# EAGLE design Extender-PCB (EAGLE 7.7.0)
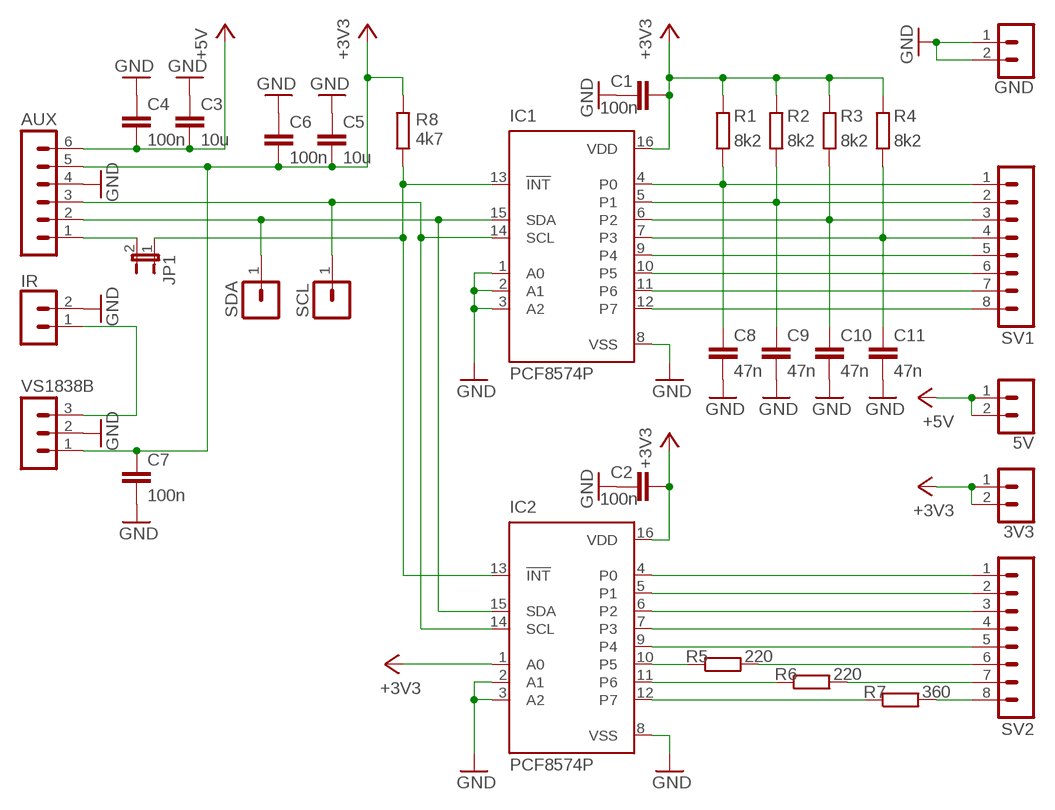
[diagram p0: schematic, sheet 1]

## Parts
3V3  MA02-1  [MA02-1]
5V  MA02-1  [MA02-1]
AUX  MA06-1  [MA06-1]
C1  100n  C-EUC1206  [C1206]
C2  100n  C-EUC1206  [C1206]
C3  10u  C-EUC1206  [C1206]
C4  100n  C-EUC1206  [C1206]
C5  10u  C-EUC1206  [C1206]
C6  100n  C-EUC1206  [C1206]
C7  100n  C-EUC1206  [C1206]
C8  47n  C-EUC1206  [C1206]
C9  47n  C-EUC1206  [C1206]
C10  47n  C-EUC1206  [C1206]
C11  47n  C-EUC1206  [C1206]
GND  MA02-1  [MA02-1]
IC1  PCF8574P  [DIL16]
IC2  PCF8574P  [DIL16]
IR  MA02-1  [MA02-1]
JP1  JP1E  [JP1]
R1  8k2  R-EU_R1206  [R1206]
R2  8k2  R-EU_R1206  [R1206]
R3  8k2  R-EU_R1206  [R1206]
R4  8k2  R-EU_R1206  [R1206]
R5  220  R-EU_0207/10  [0207/10]
R6  220  R-EU_0207/10  [0207/10]
R7  360  R-EU_0207/10  [0207/10]
R8  4k7  R-EU_0207/10  [0207/10]
SCL  MA01-1  [MA01-1]
SDA  MA01-1  [MA01-1]
SV1  MA08-1  [MA08-1]
SV2  MA08-1  [MA08-1]
VS1838B  MA03-1  [MA03-1]

## Nets
+3V3 [Stromversorgung]: 3V3.1 3V3.2 AUX.5 C1.2 C2.2 C5.2 C6.2 C7.1 IC1.16(VDD) IC2.1(A0) IC2.16(VDD) R1.2 R2.2 R3.2 R4.2 R8.2 VS1838B.1
+5V [Stromversorgung]: 5V.1 5V.2 AUX.6 C3.2 C4.2
GND [Stromversorgung]: AUX.4 C1.1 C2.1 C3.1 C4.1 C5.1 C6.1 C7.2 C8.2 C9.2 C10.2 C11.2 GND.1 GND.2 IC1.1(A0) IC1.2(A1) IC1.3(A2) IC1.8(VSS) IC2.2(A1) IC2.3(A2) IC2.8(VSS) IR.2 VS1838B.2
LED1: R5.2 SV2.6
LED2: R6.2 SV2.7
LED3: R7.2 SV2.8
N$22: AUX.1 JP1.2
N$23: IC1.13(!INT) IC2.13(!INT) JP1.1 R8.1
N$24: IR.1 VS1838B.3
P0-1: C8.1 IC1.4(P0) R1.1 SV1.1
P0-2: IC2.4(P0) SV2.1
P1-1: C9.1 IC1.5(P1) R2.1 SV1.2
P1-2: IC2.5(P1) SV2.2
P2-1: C10.1 IC1.6(P2) R3.1 SV1.3
P2-2: IC2.6(P2) SV2.3
P3-1: C11.1 IC1.7(P3) R4.1 SV1.4
P3-2: IC2.7(P3) SV2.4
P4-1: IC1.9(P4) SV1.5
P4-2: IC2.9(P4) SV2.5
P5-1: IC1.10(P5) SV1.6
P5-2: IC2.10(P5) R5.1
P6-1: IC1.11(P6) SV1.7
P6-2: IC2.11(P6) R6.1
P7-1: IC1.12(P7) SV1.8
P7-2: IC2.12(P7) R7.1
SCL: AUX.3 IC1.14(SCL) IC2.14(SCL) SCL.1
SDA: AUX.2 IC1.15(SDA) IC2.15(SDA) SDA.1

## Library data of the parts
3V3 5V GND IR = tj-library:MA02-1: PIN HEADER
AUX = con-lstb:MA06-1: PIN HEADER; OC_FARNELL: unknown; OC_NEWARK: unknown
C1-C11 = rcl:C-EU: CAPACITOR, European symbol
IC1 IC2 = micro-philips:PCF8574: I2C-Bus Remote 8-bit I/O expander http://www.semiconductors.philips.com/acrobat_download/datasheets/PCF8574_4.pdf; MPN: PCF8574PN; OC_FARNELL: 204020; OC_NEWARK: 11N8515
JP1 = jumper:JP1E: JUMPER
R1-R8 = rcl:R-EU_: RESISTOR, European symbol
SCL SDA = tj-library:MA01-1: PIN HEADER
SV1 SV2 = con-lstb:MA08-1: PIN HEADER; OC_FARNELL: unknown; OC_NEWARK: unknown
VS1838B = con-lstb:MA03-1: PIN HEADER; OC_FARNELL: unknown; OC_NEWARK: unknown

## Net classes
0 default: width 0.406 mm, clearance 0.356 mm
1 Stromversorgung: width 0.61 mm, clearance 0.356 mm

## Board
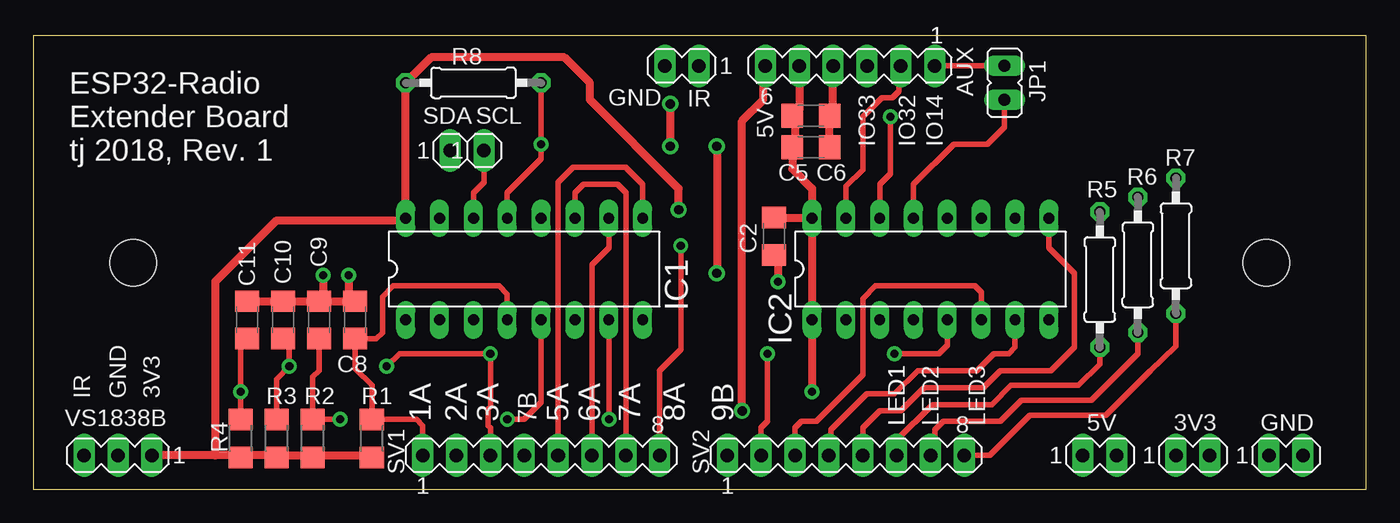
[diagram p1: board, top side]
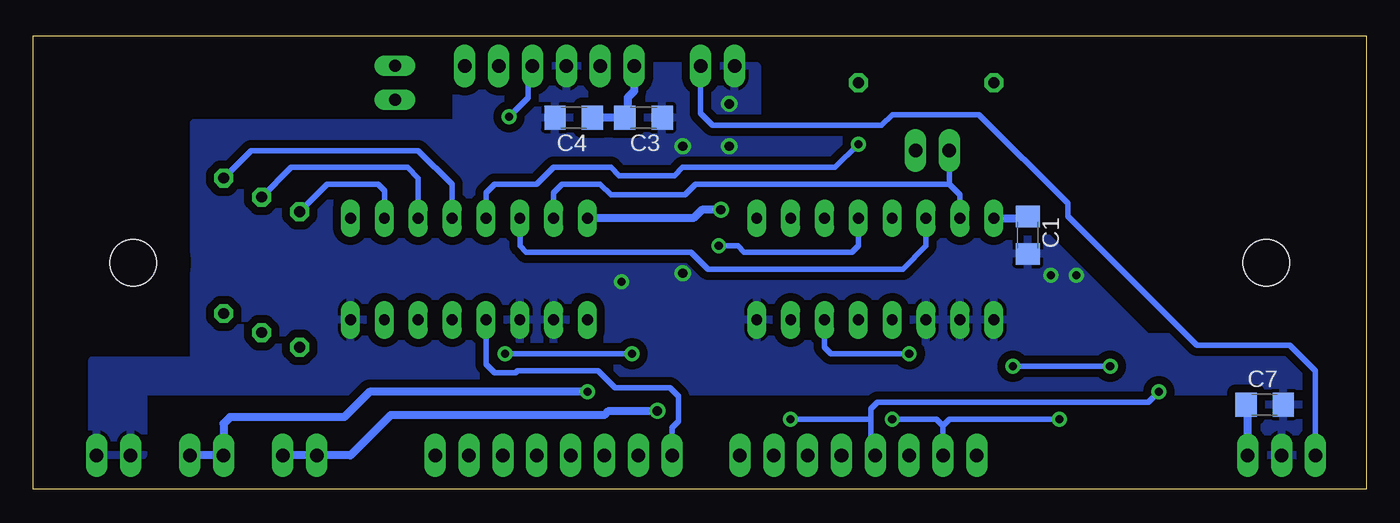
[diagram p2: board, bottom side, seen from below]

Size 100 x 34 mm. Coordinates in mm from the lower left corner, seen from the top.
Outline: 0,0 100,0 100,34 0,34 0,0
Copper layers (1*16): Top 0.035mm / dielectric 1.5mm / Bottom 0.035mm
Design rules "default *": minimum track width 10mil, minimum drill 24mil, track to track 8mil, track to pad 8mil, pad to pad 8mil, via to via 8mil, smd to smd 8mil, copper to edge 16mil, drill to drill 8mil, minimum pad ring 12mil, minimum via ring 10mil, stop-mask expansion 4mil, vias tented up to drill 0mil, thermal gap 10mil
Holes 3.5 mm at 7.5,17 92.5,17
tRestrict: area 4.7,14.2 to 10.3,19.8; area 89.8,14.2 to 95.3,19.8
bRestrict: area 4.7,14.2 to 10.3,19.8; area 89.7,14.2 to 95.3,19.8

### Footprints (pad centres in the part's own frame; a part is rotated, then mirrored left to right if it is on the bottom)
MA02-1 = drill 1.016 long: 1 -1.27,0; 2 1.27,0
MA06-1 = drill 1.016 long: 1 -6.35,0; 2 -3.81,0; 3 -1.27,0; 4 1.27,0; 5 3.81,0; 6 6.35,0
C1206 = smd 1.6 x 1.8: 1 -1.4,0; 2 1.4,0
DIL16 = drill 0.813 long: 1 -8.89,-3.81; 2 -6.35,-3.81; 3 -3.81,-3.81; 4 -1.27,-3.81; 5 1.27,-3.81; 6 3.81,-3.81; 7 6.35,-3.81; 8 8.89,-3.81; 9 8.89,3.81; 10 6.35,3.81; 11 3.81,3.81; 12 1.27,3.81; 13 -1.27,3.81; 14 -3.81,3.81; 15 -6.35,3.81; 16 -8.89,3.81
JP1 = drill 0.914 long: 1 0,-1.27; 2 0,1.27
R1206 = smd 1.6 x 1.803: 1 -1.422,0; 2 1.422,0
0207/10 = drill 0.813 octagon: 1 -5.08,0; 2 5.08,0
MA01-1 = drill 1.016 long: 1 0,0
MA08-1 = drill 1.016 long: 1 -8.89,0; 2 -6.35,0; 3 -3.81,0; 4 -1.27,0; 5 1.27,0; 6 3.81,0; 7 6.35,0; 8 8.89,0
MA03-1 = drill 1.016 long: 1 -2.54,0; 2 0,0; 3 2.54,0

### Placement (x,y rotation side)
3V3  87,2.54 0 top
5V  80.01,2.54 0 top
AUX  61.28,31.75 180 top
C1  25.4,19.05 90 bottom
C2  55.56,18.97 90 top
C3  54.21,27.86 180 bottom
C4  59.45,27.86 0 bottom
C5  58.34,28.02 180 top
C6  58.34,25.64 180 top
C7  7.62,6.35 0 bottom
C8  24.13,12.7 90 top
C9  21.43,12.7 90 top
C10  18.73,12.7 90 top
C11  16.03,12.7 90 top
GND  93.98,2.54 0 top
IC1  36.83,16.51 0 top
IC2  67.31,16.51 0 top
IR  48.66,31.75 180 top
JP1  72.87,30.48 0 top
R1  25.4,3.81 270 top
R2  20.95,3.81 270 top
R3  18.26,3.81 270 top
R4  15.56,3.81 270 top
R5  80.01,15.72 270 top
R6  82.87,16.83 270 top
R7  85.72,18.26 270 top
R8  33.02,30.48 180 top
SCL  33.81,25.4 0 top
SDA  31.27,25.4 0 top
SV1  38.1,2.54 0 top
SV2  60.96,2.54 0 top
VS1838B  6.35,2.54 180 top

### Tracks (layer width: path | path; a pad name or v marks a point on that pad's centre or on a via)
+3V3  (via drill 0.61, 0.7)
  Top 0.61: IC2.16 IC2.1 v58.42,7.3 | 17.78,2.54 15.24,2.54 | 17.78,2.54 20.32,2.54 | 17.78,2.54 R3.2 | 20.32,2.54 25.25,2.54 R1.2 | 20.32,2.54 R2.2 | 15.24,2.54 13.65,2.54 | 13.65,2.54 VS1838B.1 | 15.24,2.54 R4.2 | 13.65,2.54 13.65,15.56 18.26,20.16 27.78,20.16 IC1.16 R8.2 29.84,32.38 39.85,32.38 41.75,30.48 41.75,29.21 48.42,22.54 v48.42,20.95 | AUX.5 57.47,28.42 C5.2 57.15,27.94 57.15,26.04 C6.2 56.94,24.02 58.42,22.54 IC2.16 | C2.2 58.42,20.37 IC2.16
  Bottom 0.61: VS1838B.1 8.89,6.35 C7.1 | IC1.16 25.4,20.32 C1.2 | v58.42,7.3 74.77,7.3 76.68,5.4 85.25,5.4 85.72,4.92 3V3.1 3V3.2 | v48.42,20.95 49.85,20.95 50.48,20.32 IC2.16
+5V  (via drill 0.7)
  Top 0.61: v53.18,5.87 53.18,27.62 54.77,29.21 54.77,31.59 AUX.6
  Bottom 0.61: AUX.6 54.93,29.84 55.4,29.37 55.4,28.07 C3.2 C4.2 | 5V.2 5V.1 76.2,2.54 73.18,5.56 57.15,5.56 56.83,5.87 v53.18,5.87
GND  (via drill 0.61, 0.7)
  Top 0.61: C11.2 C10.2 C9.2 C8.2 23.65,14.58 v23.65,16.03 | C6.1 C5.1 arc-90 60.01,28.39 AUX.4 | C2.1 55.88,17.57 v55.88,15.56 | v47.78,28.89 v47.78,25.72 | v51.28,25.72 v51.28,16.19 | v21.75,16.03 21.75,13.97
  pour Bottom (isolate 0.61): 5.08,1.27 7.62,1.27 7.62,7.3 91.76,7.3 91.76,2.54 95.57,2.54 95.57,9.68 87.95,9.68 87.95,27.46 68.26,27.46 68.26,31.75 45.72,31.75 45.72,26.67 31.75,26.67 16.51,11.43 5.08,11.43
LED1
  Top 0.406: R5.2 80.01,9.37 78.42,7.78 73.34,7.78 71.91,6.35 67.47,6.35 64.77,3.65 SV2.6
LED2
  Top 0.406: R6.2 82.87,10.16 79.38,6.67 74.14,6.67 72.55,5.08 68.26,5.08 67.63,4.45 67.63,2.86 SV2.7
LED3
  Top 0.406: R7.2 85.72,10.72 83.82,8.89 80.49,5.56 74.77,5.56 71.75,2.54 SV2.8
N$22
  Top 0.406: AUX.1 JP1.2
N$23  (via drill 0.61)
  Top 0.406: IC1.13 35.56,22.23 38.1,24.77 v38.1,25.88 R8.1 | IC2.13 66.04,22.86 69.06,25.88 71.6,25.88 72.87,27.15 JP1.1
  Bottom 0.406: v38.1,25.88 39.85,24.13 51.28,24.13 51.91,23.5 56.04,23.5 56.67,24.13 60.96,24.13 62.23,22.86 65.41,22.86 66.04,22.23 IC2.13
N$24
  Bottom 0.406: VS1838B.3 3.81,8.89 5.71,10.79 12.7,10.79 22.38,20.48 22.38,21.43 29.05,28.1 35.56,28.1 36.35,27.3 49.05,27.3 49.93,28.18 IR.1
P0-1
  Top 0.406: IC1.4 35.56,14.61 34.92,15.24 26.99,15.24 26.19,14.45 26.19,11.75 25.72,11.27 24.16,11.27 | 24.16,11.27 24.16,9.02 25.4,7.78 R1.1 28.74,5.23 29.21,4.76 SV1.1 | 24.16,11.27 C8.1
P0-2
  Bottom 0.406: SV2.1 52.07,4.6 51.59,5.08 51.59,6.99 52.23,7.62 56.36,7.62 57.63,8.89 63.66,8.89 63.82,8.73 65.41,8.73 66.04,9.37 IC2.4
P1-1  (via drill 0.61)
  Top 0.406: v23.02,5.24 22.7,5.23 R2.1 20.95,8.41 21.43,8.89 C9.1 | IC1.5 38.1,6.51 36.83,5.24 v35.56,5.24
  Bottom 0.406: v35.56,5.24 32.23,5.24 31.75,4.76 | v23.02,5.24 31.27,5.24 31.75,4.76 | 31.75,4.76 SV1.2
P1-2  (via drill 0.61)
  Top 0.406: SV2.2 54.61,4.6 55.09,5.08 v55.09,10.16 | IC2.5 68.58,10.79 67.94,10.16 v64.61,10.16
  Bottom 0.406: v55.09,10.16 v64.61,10.16
P2-1  (via drill 0.61)
  Top 0.406: C10.1 19.21,10.82 v19.21,9.21 18.26,8.26 R3.1 | v26.51,9.21 27.46,10.16 v34.29,10.16 34.29,6.19 34.13,6.03 34.13,4.76 34.29,4.6 SV1.3
  Bottom 0.406: v34.29,10.16 40.16,10.16 40.64,10.64 IC1.6 | v26.51,9.21 v19.21,9.21
P2-2
  Top 0.406: SV2.3 57.15,4.6 57.63,5.08 58.74,5.08 62.23,8.57 62.23,14.29 63.18,15.24 70.64,15.24 71.12,14.76 IC2.6
P3-1  (via drill 0.61)
  Top 0.406: v43.18,5.24 IC1.7 | R4.1 v15.56,7.3 15.56,10.82 C11.1
  Bottom 0.406: 37.15,5.24 v43.18,5.24 | v15.56,7.3 16.35,6.51 36.67,6.51 37.15,6.03 37.15,5.24 | SV1.4 37.15,2.86 37.15,5.24
P3-2
  Top 0.406: IC2.7 73.66,10.64 73.18,10.16 72.07,10.16 70.8,8.89 66.36,8.89 64.61,7.14 62.55,7.14 59.85,4.45 59.85,2.7 SV2.4
P4-1
  Top 0.406: IC1.9 45.72,22.86 44.53,24.05 44.45,24.13 40.48,24.13 39.37,23.02 SV1.5
P4-2
  Top 0.406: IC2.9 76.2,18.1 78.11,16.19 78.11,10.64 76.36,8.89 72.55,8.89 71.28,7.62 66.83,7.62 65.09,5.87 63.5,5.87 62.23,4.6 SV2.5
P5-1
  Top 0.406: SV1.6 41.91,16.83 43.18,18.1 IC1.10
P5-2
  Bottom 0.406: R5.1 77.95,22.86 74.14,22.86 73.66,22.38 IC2.10
P6-1
  Top 0.406: IC1.11 40.64,22.23 41.27,22.86 43.81,22.86 44.45,22.23 SV1.7
P6-2
  Bottom 0.406: R6.1 80.64,24.13 71.91,24.13 71.12,23.34 IC2.11
P7-1  (via drill 0.61)
  Top 0.406: v48.58,18.26 48.58,10.48 46.99,8.89 SV1.8
  Bottom 0.406: IC1.12 38.1,18.26 38.58,17.78 46.67,17.78 47.15,18.26 v48.58,18.26
P7-2
  Bottom 0.406: R7.1 83.66,25.4 71.12,25.4 68.58,22.86 IC2.12
SCL  (via drill 0.61)
  Top 0.406: IC1.14 33.02,22.23 33.81,23.02 SCL.1 | 63.46,20.28 IC2.14 63.5,22.86 64.29,23.65 v64.29,27.94
  Bottom 0.406: IC1.14 33.02,18.26 34.77,16.51 49.37,16.51 50.64,17.78 63.02,17.78 63.5,18.26 IC2.14 | v64.29,27.94 62.87,29.37 62.87,31.43 AUX.3
SDA
  Top 0.406: IC2.15 60.96,22.7 62.23,23.97 62.23,27.94 63.66,29.37 64.45,29.37 64.93,29.84 64.93,31.59 AUX.2
  Bottom 0.406: SDA.1 31.27,22.86 | 31.27,22.86 30.48,22.07 IC1.15 | 31.27,22.86 50.32,22.86 51.12,22.07 56.67,22.07 57.47,22.86 60.33,22.86 60.96,22.23 IC2.15

### Text on the board
tPlace: GND | 5V | IO33 | IO32 | IO14 | ESP32-Radio / Extender Board / tj 2018, Rev. 1 | IR | GND | 3V3 | 1A | 2A | 3A | 7B | 5A | 6A | 7A | 8A | 9B | LED1 | LED1 | LED2 | LED3